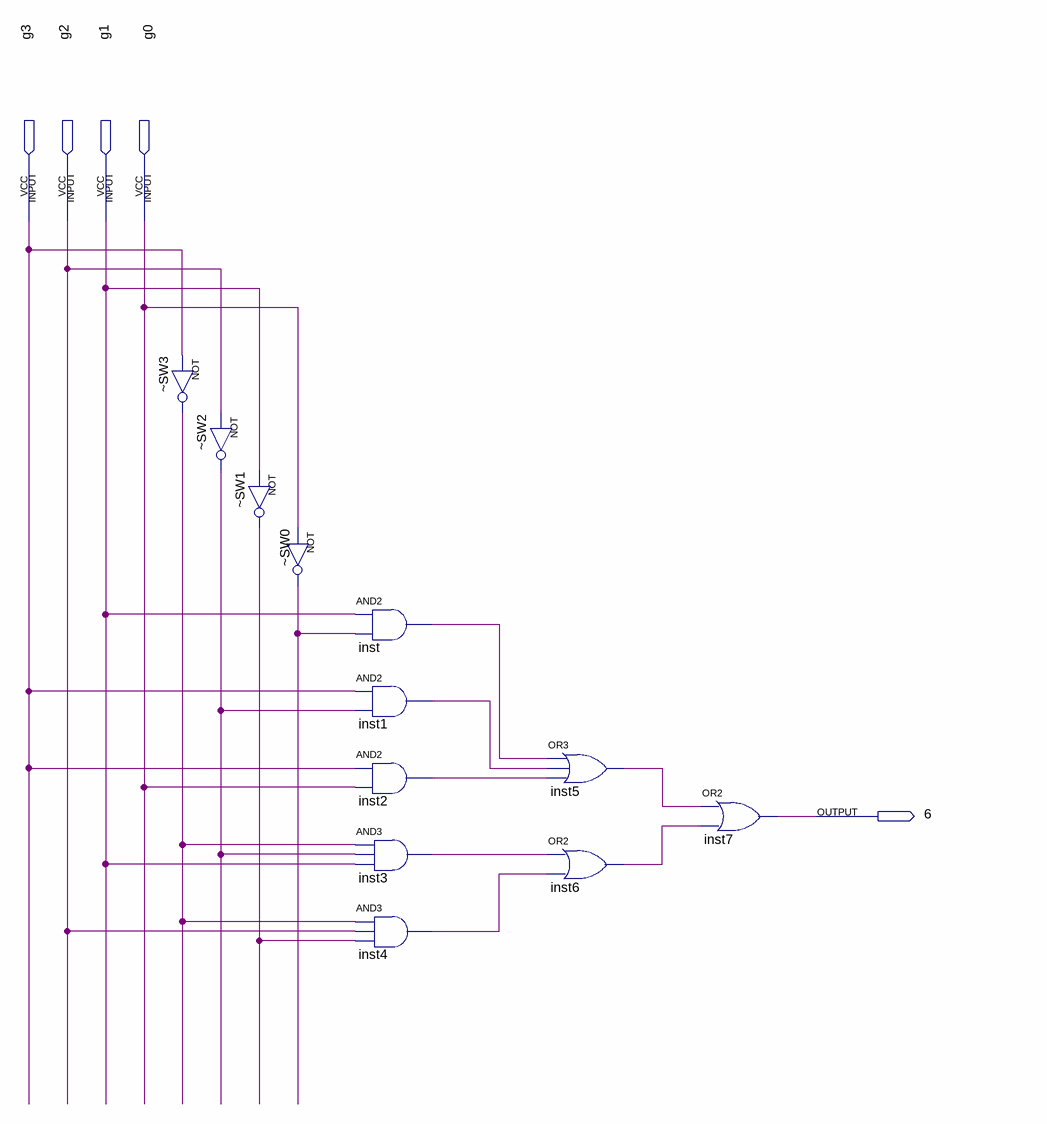
[diagram p0: schematic sheet]
// Quartus schematic 6.bdf as structural Verilog: 12 symbols, 5 pins
module \6  (
  input  g3,
  input  g2,
  input  g1,
  input  g0,
  output \6 
);

  wire _SW0_out, _SW1_out, _SW2_out, _SW3_out, inst1_out, inst2_out, inst3_out, inst4_out, inst5_out,
       inst6_out, inst_out;

  not \u_~SW3  (_SW3_out, g3);
  not \u_~SW2  (_SW2_out, g2);
  not \u_~SW1  (_SW1_out, g1);
  not \u_~SW0  (_SW0_out, g0);
  and inst (inst_out, g1, _SW0_out);
  and inst1 (inst1_out, g3, _SW2_out);
  and inst2 (inst2_out, g3, g0);
  and inst3 (inst3_out, _SW3_out, _SW2_out, g1);
  and inst4 (inst4_out, _SW3_out, g2, _SW1_out);
  or inst5 (inst5_out, inst_out, inst1_out, inst2_out);
  or inst6 (inst6_out, inst3_out, inst4_out);
  or inst7 (\6 , inst5_out, inst6_out);
endmodule
